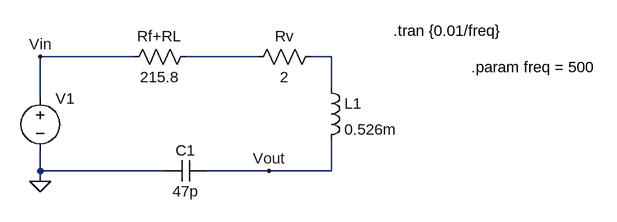
[diagram p0: schematic EsquematicoConSimulacionTP3.asc]
EsquematicoConSimulacionTP3.asc, the LTspice schematic file:
Version 4
SHEET 1 956 680
WIRE 208 32 64 32
WIRE 400 32 288 32
WIRE 512 32 480 32
WIRE 512 80 512 32
WIRE 64 96 64 32
WIRE 64 208 64 176
WIRE 256 208 64 208
WIRE 416 208 320 208
WIRE 512 208 512 160
WIRE 512 208 416 208
WIRE 64 224 64 208
FLAG 64 224 0
FLAG 64 32 Vin
FLAG 416 208 Vout
SYMBOL voltage 64 80 R0
WINDOW 3 -323 117 Invisible 2
WINDOW 123 0 0 Left 0
WINDOW 39 0 0 Left 0
SYMATTR Value PULSE(0 5 0 1n 1n {0.5/freq} {1/freq})
SYMATTR InstName V1
SYMBOL res 304 16 R90
WINDOW 0 0 56 VBottom 2
WINDOW 3 32 56 VTop 2
SYMATTR InstName Rf+RL
SYMATTR Value 215.8
SYMBOL res 384 48 R270
WINDOW 0 32 56 VTop 2
WINDOW 3 0 56 VBottom 2
SYMATTR InstName Rv
SYMATTR Value 2
SYMBOL ind 496 64 R0
SYMATTR InstName L1
SYMATTR Value 0.526m
SYMBOL cap 320 192 R90
WINDOW 0 0 32 VBottom 2
WINDOW 3 32 32 VTop 2
SYMATTR InstName C1
SYMATTR Value 47p
TEXT 608 -8 Left 2 !.tran {0.01/freq}
TEXT 728 48 Left 2 !.param freq = 500

The netlist it stands for:
* EsquematicoConSimulacionTP3.asc
V1 Vin 0 PULSE(0 5 0 1n 1n {0.5/freq} {1/freq})
Rf+RL N001 Vin 215.8
Rv N001 N002 2
L1 N002 Vout 0.526m
C1 Vout 0 47p
.tran {0.01/freq}
.param freq = 500
.backanno
.end